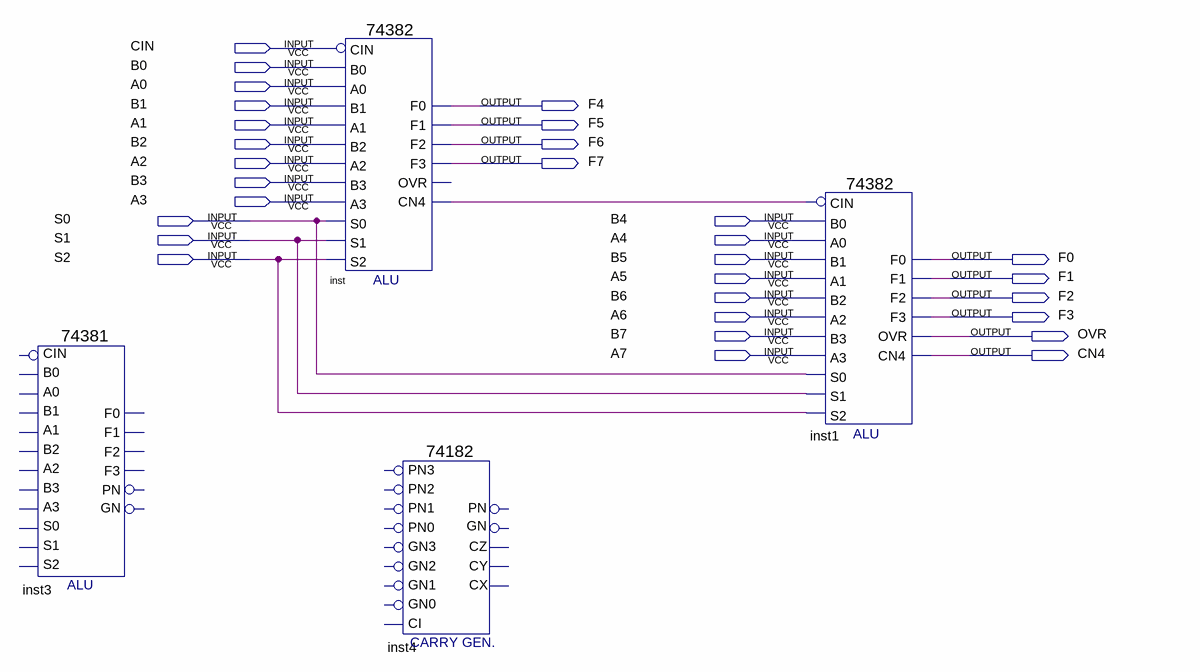
[diagram p0: schematic sheet]
// Quartus schematic a3.bdf as structural Verilog: 4 symbols, 30 pins
module a3 (
  input  CIN,
  input  B0,
  input  A0,
  input  B1,
  input  A1,
  input  B2,
  input  A2,
  input  B3,
  input  A3,
  input  S0,
  input  B4,
  input  S1,
  input  A4,
  input  S2,
  input  B5,
  input  A5,
  input  B6,
  input  A6,
  input  B7,
  input  A7,
  output F4,
  output F5,
  output F6,
  output F7,
  output F0,
  output F1,
  output F2,
  output F3,
  output OVR,
  output CN4
);

  wire inst_cn4;

  \74381  inst3 ();  // open: A1, CIN, B1, A0, B0, A3, A2, B3, B2, S2, S1, S0, F0, F1, F3, F2, GN, PN
  \74382  inst (
    .B3(B3), .A3(A3), .B0(B0), .A0(A0), .B1(B1), .S2(S2), .S1(S1), .S0(S0), .A1(A1), .B2(B2), .A2(A2),
    .CIN(CIN), .F1(F5), .F0(F4), .CN4(inst_cn4), .F3(F7), .F2(F6));  // open: OVR
  \74182  inst4 ();  // open: PN2, GN2, GN3, PN3, CI, PN1, PN0, GN1, GN0, CY, PN, CX, CZ, GN
  \74382  inst1 (
    .B3(B7), .A3(A7), .B0(B4), .A0(A4), .B1(B5), .S2(S2), .S1(S1), .S0(S0), .A1(A5), .B2(B6), .A2(A6),
    .CIN(inst_cn4), .F1(F1), .F0(F0), .CN4(CN4), .F3(F3), .F2(F2), .OVR(OVR));
endmodule
